# EAGLE schematic riffle-beta-0.1.8.5 (EAGLE 7.5.0)
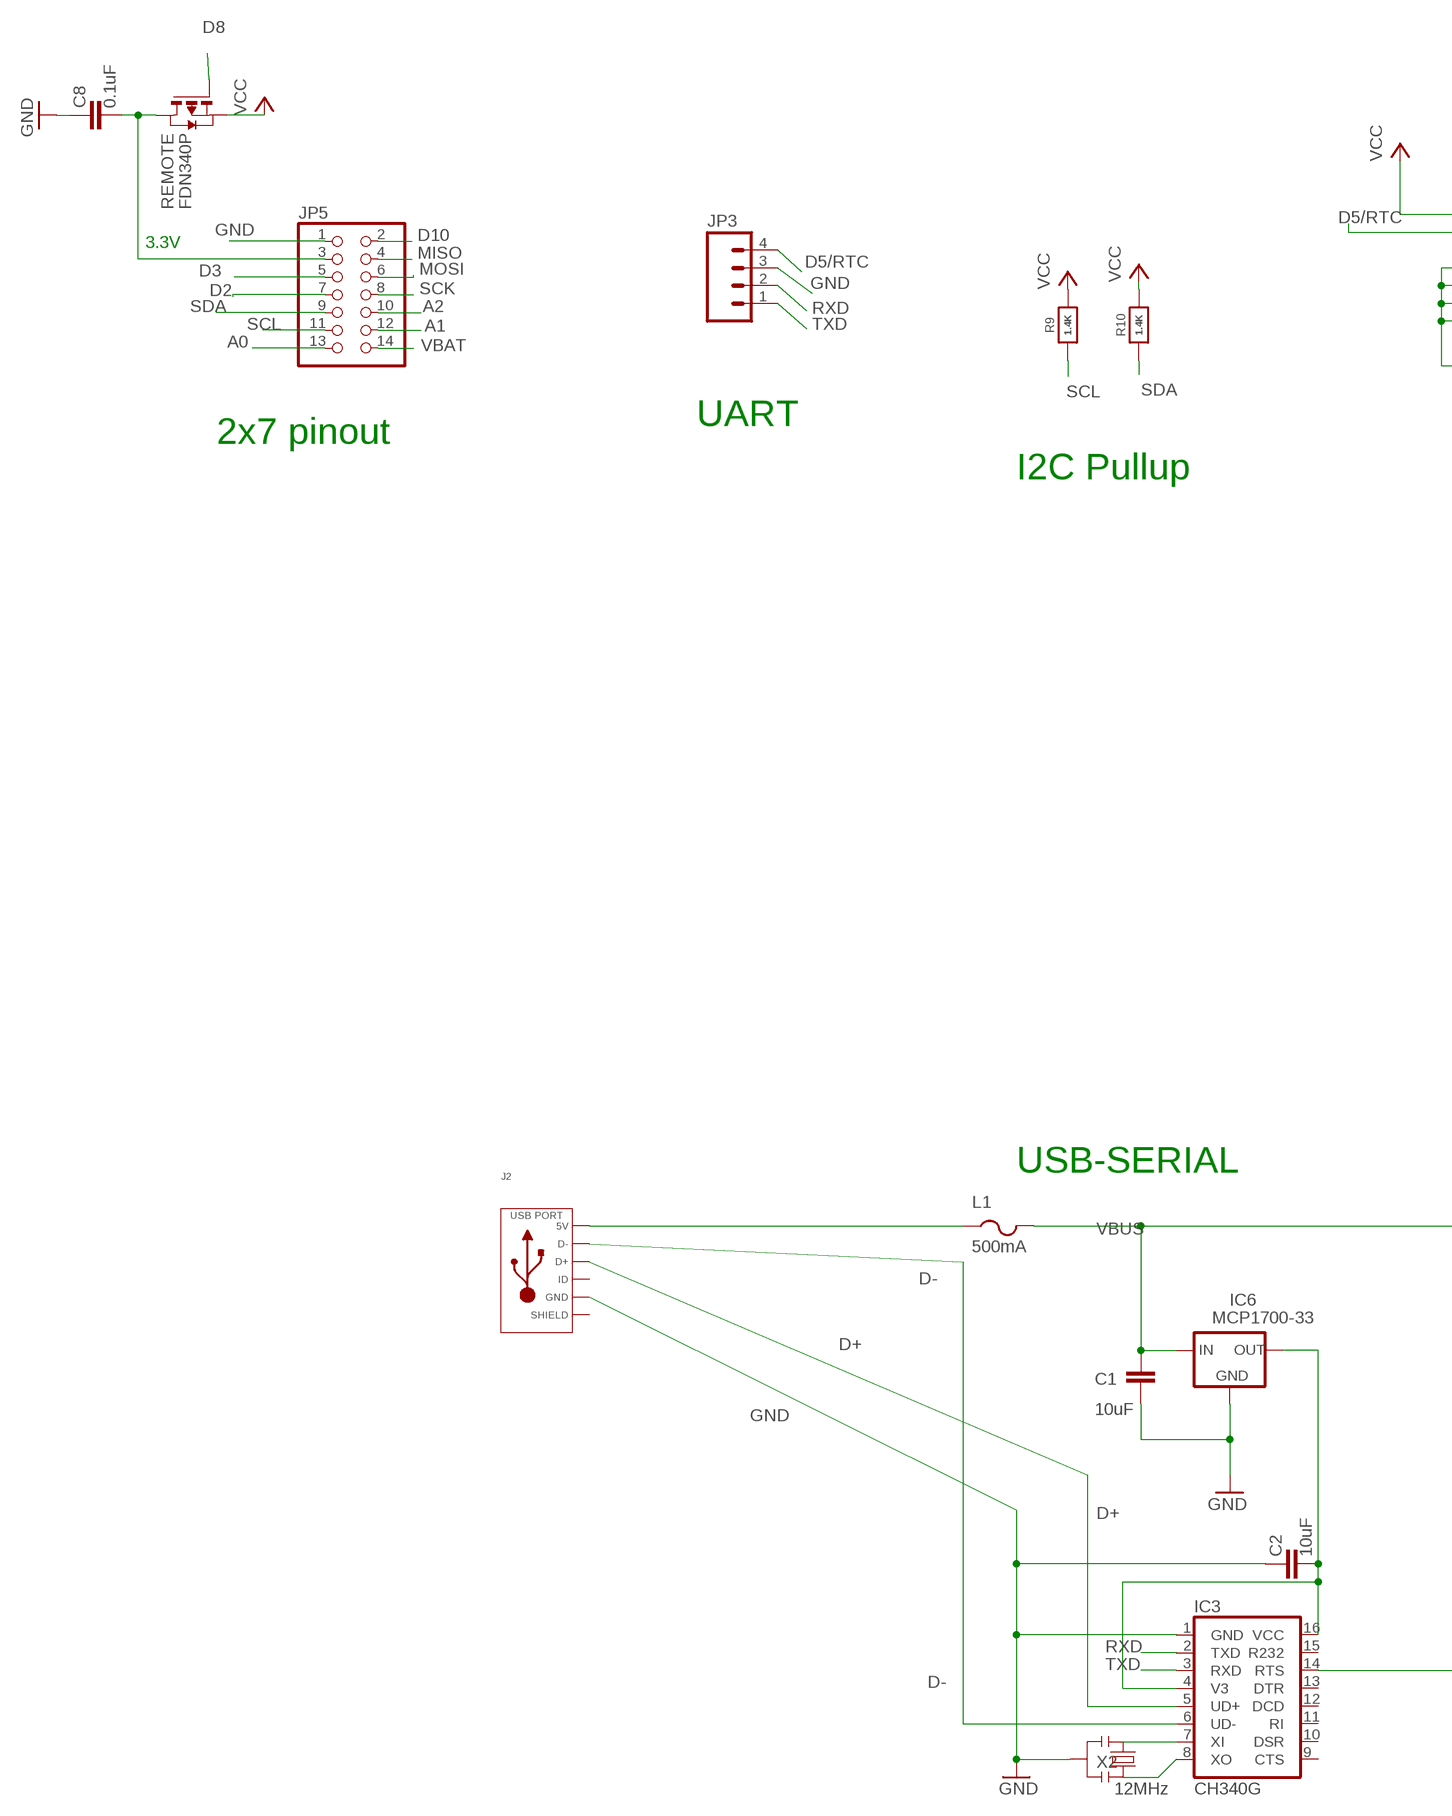
[diagram p0: schematic, sheet 1, part 1 of 2]
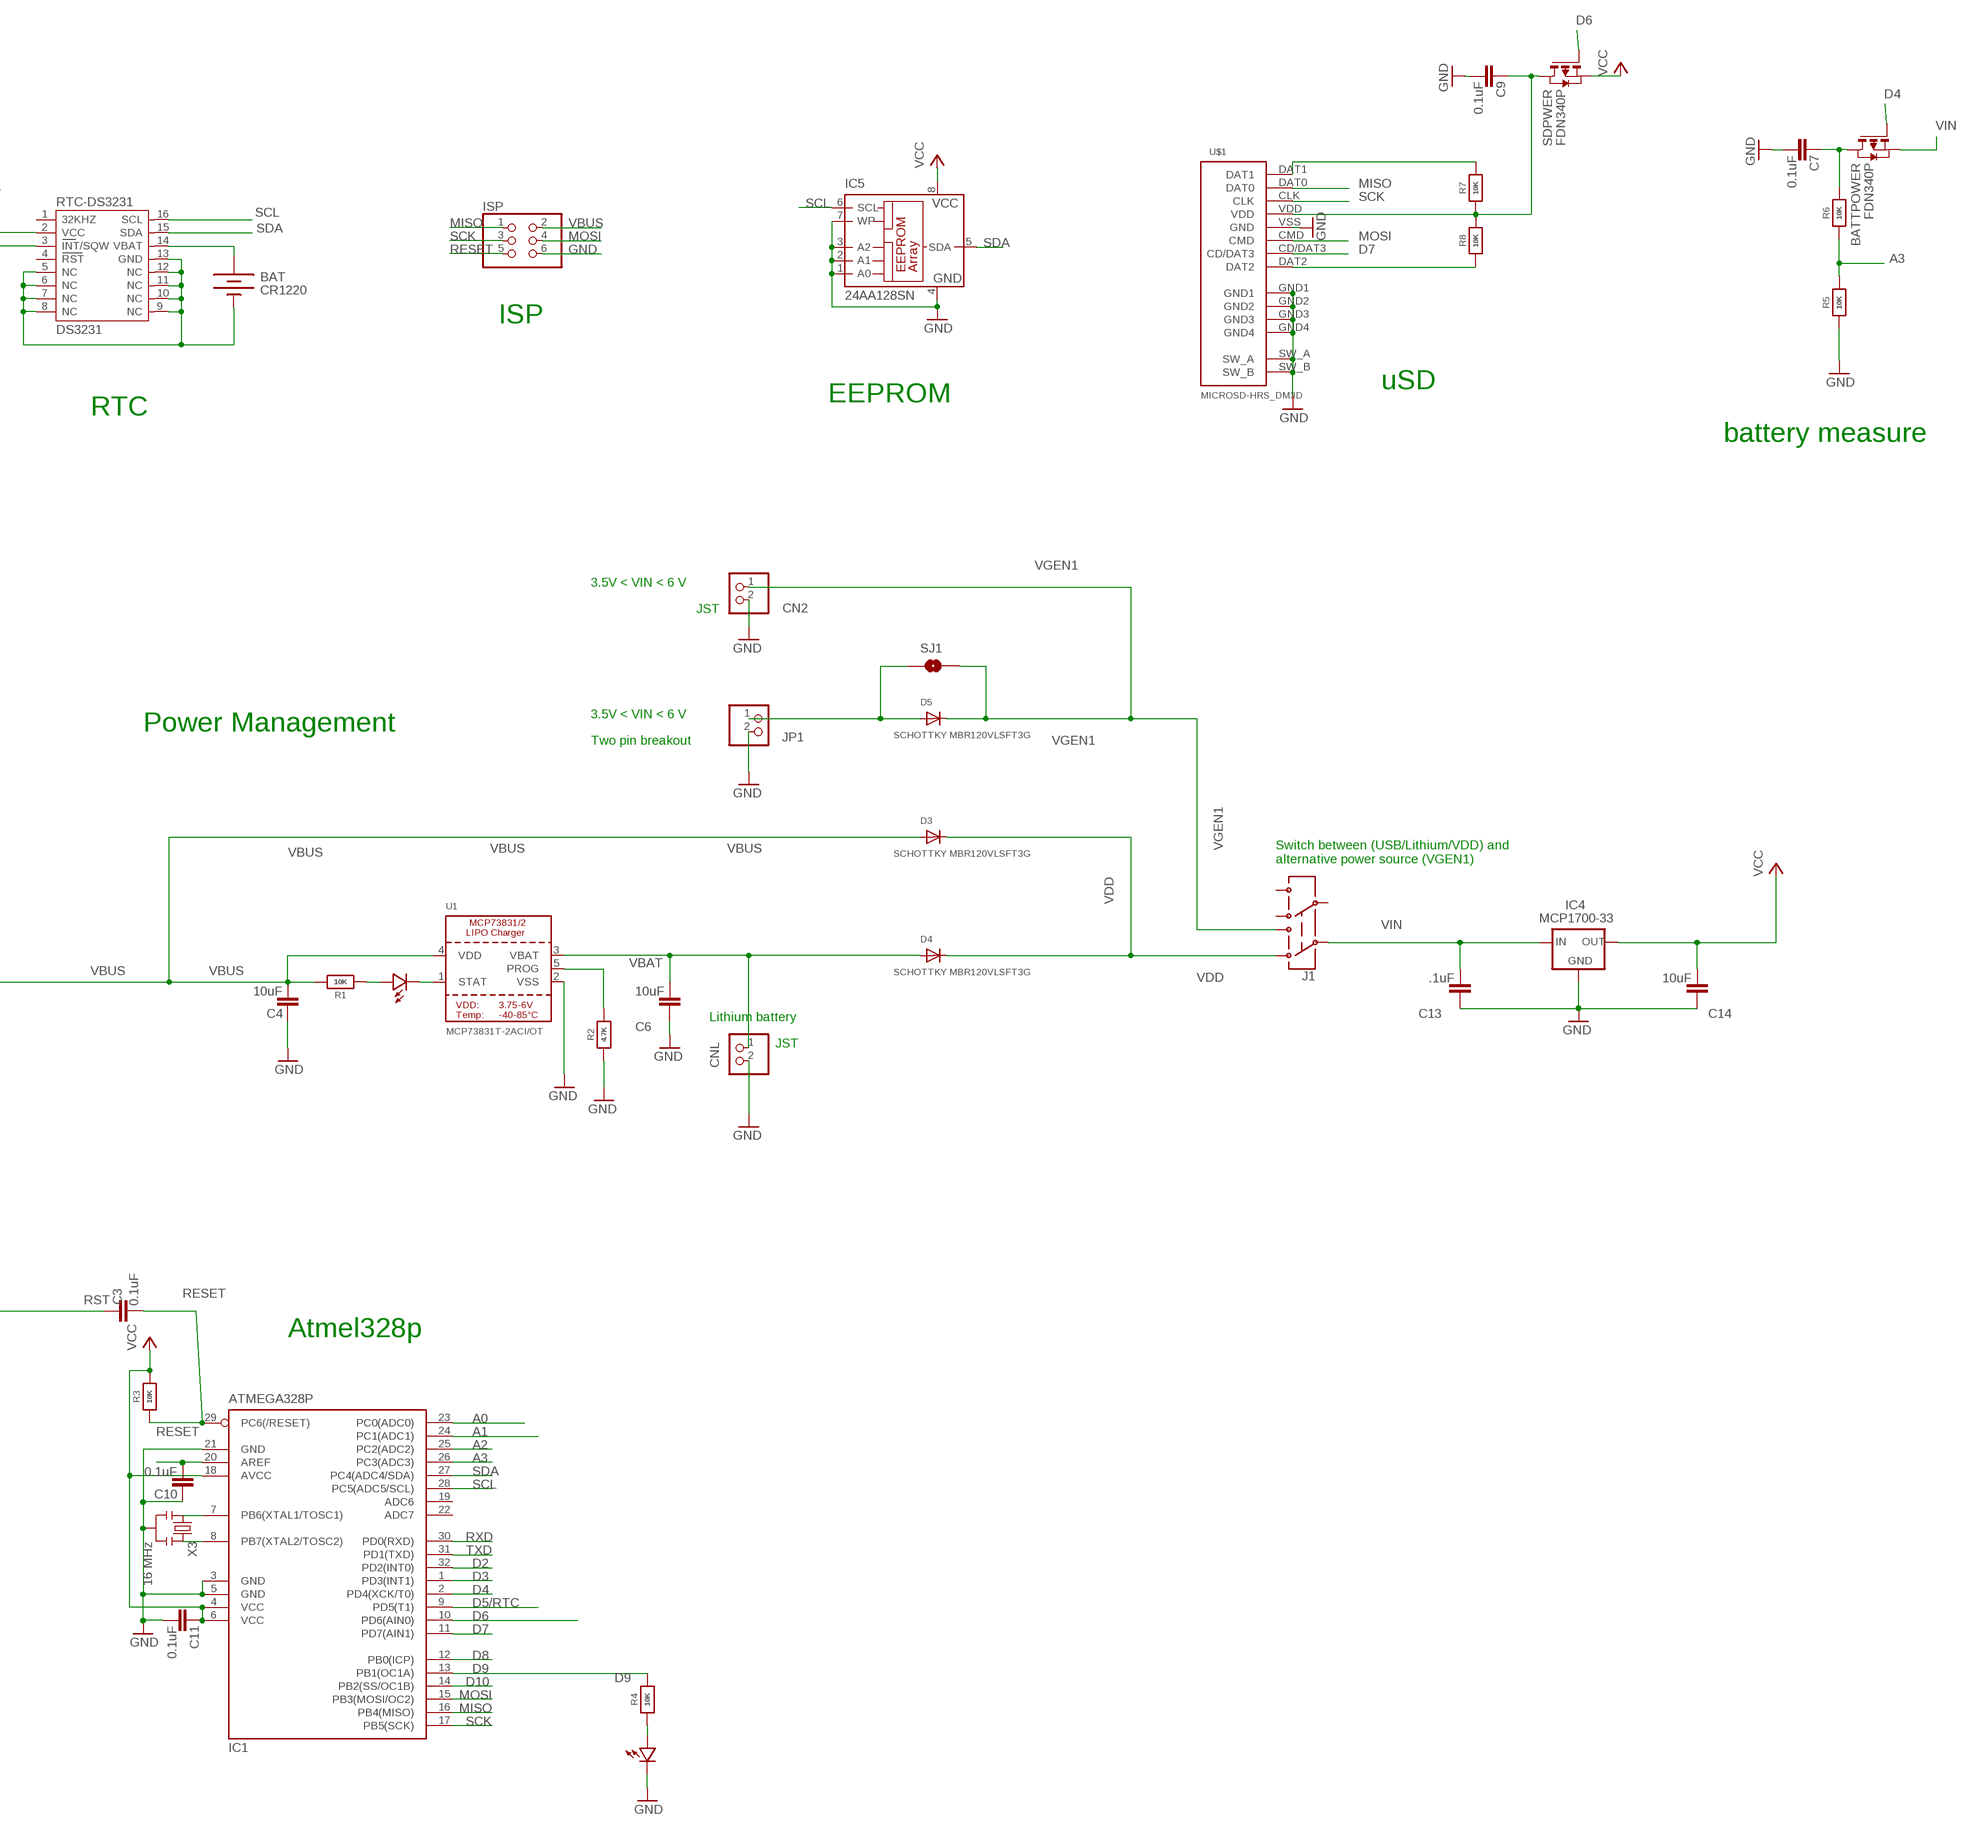
[diagram p1: schematic, sheet 1, part 2 of 2]

## Parts
BAT  CR1220  BATTERYBATTERY_12MM_SMT  [BATTCON_12MM_SMT]
BATTPOWER  FDN340P  PMOSSOT23  [SOT-23]
C1  10uF  CAP0603-CAP  [0603-CAP]
C2  10uF  CAP0603-CAP  [0603-CAP]
C3  0.1uF  CAP0603-CAP  [0603-CAP]
C4  10uF  CAP0603-CAP  [0603-CAP]
C6  10uF  CAP0603-CAP  [0603-CAP]
C7  0.1uF  CAP0603-CAP  [0603-CAP]
C8  0.1uF  CAP0603-CAP  [0603-CAP]
C9  0.1uF  CAP0603-CAP  [0603-CAP]
C10  0.1uF  CAP0603-CAP  [0603-CAP]
C11  0.1uF  CAP0603-CAP  [0603-CAP]
C13  .1uF  CAP0603-CAP  [0603-CAP]
C14  10uF  CAP0603-CAP  [0603-CAP]
CN2  JST_2PIN-SMT-RA  [JST-PH-2-SMT-RA]
CNL  JST_2PIN-SMT-RA  [JST-PH-2-SMT-RA]
D1  LED0603  [0603-LED]
D2  LED0603  [0603-LED]
D3  SCHOTTKY MBR120VLSFT3G  DIODE_SOD-123FL  [SOD-123FL]
D4  SCHOTTKY MBR120VLSFT3G  DIODE_SOD-123FL  [SOD-123FL]
D5  SCHOTTKY MBR120VLSFT3G  DIODE_SOD-123FL  [SOD-123FL]
IC1  ATMEGA328P  MEGA8-AI  [TQFP32-08]
IC3  CH340G  [SO16]
IC4  MCP1700-33  MCP1700SOT89  [SOT89]
IC5  24AA128SN  [SO-08]
IC6  MCP1700-33  MCP1700SOT89  [SOT89]
ISP  PINHD-2X3  [2X03]
J1  AYZ0202  [AYZ0202]
J2  USB_MICRO_RIGHT  [MICROUSB-RIGHT]
JP1  PINHD-1X2  [1X02]
JP3  M04SMD  [1X04-SMD]
JP5  PINHD-2X7  [2X07]
L1  500mA  PTCFUSE-1206  [R1206]
R1  10K  RESISTOR_0603_NOOUT  [0603-NO]
R2  4.7K  RESISTOR_0603_NOOUT  [0603-NO]
R3  10K  RESISTOR_0603_NOOUT  [0603-NO]
R4  10K  RESISTOR_0603_NOOUT  [0603-NO]
R5  10K  RESISTOR_0603_NOOUT  [0603-NO]
R6  10K  RESISTOR_0603_NOOUT  [0603-NO]
R7  10K  RESISTOR_0603_NOOUT  [0603-NO]
R8  10K  RESISTOR_0603_NOOUT  [0603-NO]
R9  1.4K  RESISTOR_0603_NOOUT  [0603-NO]
R10  1.4K  RESISTOR_0603_NOOUT  [0603-NO]
REMOTE  FDN340P  PMOSSOT23  [SOT-23]
RTC-DS3231  DS3231  [DS3231]
SDPWER  FDN340P  PMOSSOT23  [SOT-23]
SJ1  SOLDERJUMPERNO  [SJ_2S-NO]
U1  MCP73831T-2ACI/OT  MCP73831/2  [SOT23-5]
U$1  MICROSD-HRS_DM3D  [DM3D]
X2  12MHz  RESONATORSMD  [RESONATOR-SMD]
X3  16 MHz  RESONATORSMD  [RESONATOR-SMD]

## Nets
A0: IC1.23(PC0(ADC0)) JP5.13
A1: IC1.24(PC1(ADC1)) JP5.12
A2: IC1.25(PC2(ADC2)) JP5.10
A3: IC1.26(PC3(ADC3)) R5.2 R6.1
AREF: C10.1 IC1.20(AREF)
D2: IC1.32(PD2(INT0)) JP5.7
D3: IC1.1(PD3(INT1)) JP5.5
D4: BATTPOWER.3(G) IC1.2(PD4(XCK/T0))
D5/RTC: IC1.9(PD5(T1)) JP3.4 RTC-DS3231.3(INT/SQW)
D6: IC1.10(PD6(AIN0)) SDPWER.3(G)
D7: IC1.11(PD7(AIN1)) U$1.CD/DAT3
D8: IC1.12(PB0(ICP)) REMOTE.3(G)
D9: IC1.13(PB1(OC1A)) R4.2
D10: IC1.14(PB2(SS/OC1B)) JP5.2
D+: IC3.5(UD+) J2.3(D+)
D-: IC3.6(UD-) J2.2(D-)
GND: BAT.P$1(-) C1.1 C2.2 C4.2 C6.2 C7.1 C8.2 C9.1 C10.2 C11.1 C13.2 C14.2 CN2.2 CNL.2 D2.MINUS IC1.3(GND) IC1.5(GND) IC1.21(GND) IC3.1(GND) IC4.1(GND) IC5.1(A0) IC5.2(A1) IC5.3(A2) IC5.4(GND) IC5.7(WP) IC6.1(GND) ISP.6 J2.5(GND) JP1.2 JP3.3 JP5.1 R2.1 R5.1 RTC-DS3231.5(NC) RTC-DS3231.6(NC) RTC-DS3231.7(NC) RTC-DS3231.8(NC) RTC-DS3231.9(NC) RTC-DS3231.10(NC) RTC-DS3231.11(NC) RTC-DS3231.12(NC) RTC-DS3231.13(GND) U1.2(VSS) U$1.GND1 U$1.GND2 U$1.GND3 U$1.GND4 U$1.SW_A U$1.SW_B U$1.VSS(GND) X2.2 X3.2
MISO: IC1.16(PB4(MISO)) ISP.1 JP5.4 U$1.DAT0
MOSI: IC1.15(PB3(MOSI/OC2)) ISP.4 JP5.6 U$1.CMD
N$2: IC1.7(PB6(XTAL1/TOSC1)) X3.1
N$3: IC1.8(PB7(XTAL2/TOSC2)) X3.3
N$4: C9.2 R7.1 R8.2 SDPWER.1(D) U$1.VDD
N$5: D1.MINUS U1.1(STAT)
N$6: R2.2 U1.5(PROG)
N$7: C8.1 JP5.3 REMOTE.1(D)
N$8: C2.1 IC3.4(V3) IC3.16(VCC) IC6.3(OUT)
N$9: J2.1(5V) L1.1
N$10: D5.A JP1.1 SJ1.1
N$11: IC3.7(XI) X2.1
N$13: IC3.8(XO) X2.3
N$15: BATTPOWER.1(D) C7.2 R6.2
N$16: R7.2 U$1.DAT1
N$17: D2.PLUS R4.1
N$18: R8.1 U$1.DAT2
N$19: D1.PLUS R1.1
RESET: C3.1 IC1.29(PC6(/RESET)) ISP.5 R3.1
RST: C3.2 IC3.14(RTS)
RTC_BATT: BAT.P$2(+) RTC-DS3231.14(VBAT)
RXD: IC1.30(PD0(RXD)) IC3.2(TXD) JP3.2
SCK: IC1.17(PB5(SCK)) ISP.3 JP5.8 U$1.CLK
SCL: IC1.28(PC5(ADC5/SCL)) IC5.6(SCL) JP5.11 R9.1 RTC-DS3231.16(SCL)
SDA: IC1.27(PC4(ADC4/SDA)) IC5.5(SDA) JP5.9 R10.1 RTC-DS3231.15(SDA)
TXD: IC1.31(PD1(TXD)) IC3.3(RXD) JP3.1
VBAT [power]: C6.1 CNL.1 D4.A JP5.14 U1.3(VBAT)
VBUS [power]: C1.2 C4.1 D3.A IC6.2(IN) ISP.2 L1.2 R1.2 U1.4(VDD)
VCC: C11.2 C14.1 IC1.4(VCC) IC1.6(VCC) IC1.18(AVCC) IC4.3(OUT) IC5.8(VCC) R3.2 R9.2 R10.2 REMOTE.2(S) RTC-DS3231.2(VCC) SDPWER.2(S)
VDD: D3.C D4.C J1.3
VGEN1: CN2.1 D5.C J1.1 SJ1.2
VIN: BATTPOWER.2(S) C13.1 IC4.2(IN) J1.2
Unconnected: IC1.19(ADC6) IC1.22(ADC7) IC3.9(CTS) IC3.10(DSR) IC3.11(RI) IC3.12(DCD) IC3.13(DTR) IC3.15(R232) J1.4 J1.5 J1.6 J2.4(ID) RTC-DS3231.1(32KHZ) RTC-DS3231.4(RST)

## Notes on the sheet
- 3.3V
- ISP
- UART | uSD
- 2x7 pinout | EEPROM
- RTC
- I2C Pullup
- battery measure
- 3.5V < VIN < 6 V
- JST
- 3.5V < VIN < 6 V
- Power Management
- Two pin breakout
- Switch between (USB/Lithium/VDD) and 
  alternative power source (VGEN1)
- USB-SERIAL
- Lithium battery
- JST
- Atmel328p

## Power pins joined to a net without a drawn wire
SLD: J2.S1(SLD) J2.S2(SLD) J2.S3(SLD) J2.S4(SLD) J2.S5(SLD) J2.S6(SLD) J2.S7(SLD) J2.S8(SLD)

## Library data of the parts
BAT = SparkFunNew:BATTERY: Battery Holders Various common sizes : AA, AAA, 20mm coin cell and 12mm coin cell.
BATTPOWER REMOTE SDPWER = zetex:PMOSSOT23: MOS FET; OC_FARNELL: unknown; OC_NEWARK: unknown
C1-C4 C6-C11 C13 C14 = SparkFun:CAP: Capacitor Standard 0603 ceramic capacitor, and 0.1" leaded capacitor.
CN2 CNL = adafruit:JST_2PIN: JST 2-Pin Connectors of various flavors SMT-RA (S2B-PH-SM4) 4UConnector #17311 SMT (B2B-PH-SM4) THM-RA (S2B-PH) THM (B2B-PH)
D1 D2 = LowPowerLab:LED
D3-D5 = adafruit:DIODE: Diode SMADIODE - SMA Surface Mount Package 20V 1A Schottky Diode Digikey: 641-1014-6-ND DO-1N4148 - Through Hole Small Current Diode SOD-123 20V 1 A (.5mV Vf) Schottky Diode - Digikey: MBRX120TPMSCT-ND SOD-323 10V 570mA (.38mV Vf, 3ns) Schottky Diode - Digikey: ZLLS410CT-ND SOD-523 30V 30mA Schottky Diode (RB751S-40TE61) - Digikey: RB751S-40TE61CT-ND SOT23-R/W - SOT23 Package (R = Solder Paste/Reflow Ovens, W = Hand-Soldering) BAT54Film 40V 300mA - Digikey: 497-7162-1-ND
IC1 = atmel:MEGA8: MICROCONTROLLER 8 Kbytes FLASH, 1 kbytes SRAM, 512 bytes EEPROM, USART, 6-channel 10 bit ADC, 2-channel 8 bit ADC Pin compatible with Atmega48, ATMega88, ATMega168 Source: avr.lbr; MPN: ATMEGA8-16AU; OC_FARNELL: 9171371; OC_NEWARK: 73M8863
IC3 = SparkFunNew:CH340
IC4 IC6 = adafruit:MCP1700: VOLTAGE REGULATOR
IC5 = microchip:24*: Serial EEPROM I2C; MF: MICROCHIP; MPN: 24AA128-I/SN; OC_FARNELL: unknown; OC_NEWARK: 92C6842
ISP = pinhead:PINHD-2X3: PIN HEADER
J1 = SparkFunNew:AYZ0202: SPDT Slide Switch Simple SMD single-pull double-throw slide switch. Good for less than 350mA power switch, switching UARTs between devices, etc. Spark Fun Electronics SKU : COM-00597
J2 = MF_Connectors:USB: Library: MF_Connectors Description: 5 Pin USB Connectors. SLD is the shield connection. Usually tied to ground through a small ferrite bead.
JP1 = pinhead:PINHD-1X2: PIN HEADER
JP3 = SparkFun:M04: Header 4 Standard 4-pin 0.1" header. Use with straight break away headers (SKU : PRT-00116), right angle break away headers (PRT-00553), swiss pins (PRT-00743), machine pins (PRT-00117), and female headers (PRT-00115). Molex polarized connector foot print use with SKU : PRT-08231 with associated crimp pins and housings.
JP5 = pinhead:PINHD-2X7: PIN HEADER
L1 = adafruit:PTCFUSE: PTC fuses, resettable thermistors
R1-R10 = microbuilder:RESISTOR: Resistors For new designs, use the packages preceded by an '_' character since they are more reliable: The following footprints should be used on most boards: _0402 - Standard footprint for regular board layouts _0603 - Standard footprint for regular board layouts _0805 - Standard footprint for regular board layouts _1206 - Standard footprint for regular board layouts For extremely tight-pitch boards where space is at a premium, the following 'micro-pitch' footprints can be used (smaller pads, no silkscreen outline, etc.): _0402MP - Micro-pitch footprint for very dense/compact boards _0603MP - Micro-pitch footprint for very dense/compact boards _0805MP - Micro-pitch footprint for very dense/compact boards _1206MP - Micro-pitch footprint for very dense/compact boards
RTC-DS3231 = _lh-library:DS3231
SJ1 = SparkFun-Retired:SOLDERJUMPER: Solder Jumper Standard SMD solder jumper. Used to automate production. Two varients : Normally Open and Normally Closed are the same, but have different paste layers. NC will have a large amount of paste and should jumper during reflow.
U1 = microbuilder:MCP73831/2: MCP73831/2 LIPO Charger VDD: 3.75 - 6V Temp -40 - 85°C Programmable Charge Rate: 15-500mA NOTE: STAT is a tri-state logic output on the MCP73831 and an open-drain output on the MCP73832. SOT23-5 with 4.2V output and tri-state logic on STAT = MCP73831T-2ACI/OT
U$1 = hrs_DM3D-SF:MICROSD-HRS_DM3D
X2 = SparkFunNew:RESONATOR: Resonator Small SMD resonator. This is the itty bitty 10/20MHz resonators with built in caps. CSTCE10M0G55 and CSTCE20M0V53. Footprint has been reviewed closely but hasn't been tested yet.
X3 = SparkFun:RESONATOR: Resonator Small SMD resonator. This is the itty bitty 10/20MHz resonators with built in caps. CSTCE10M0G55 and CSTCE20M0V53. Footprint has been reviewed closely but hasn't been tested yet.

## Net classes
1 power: width 0.305 mm